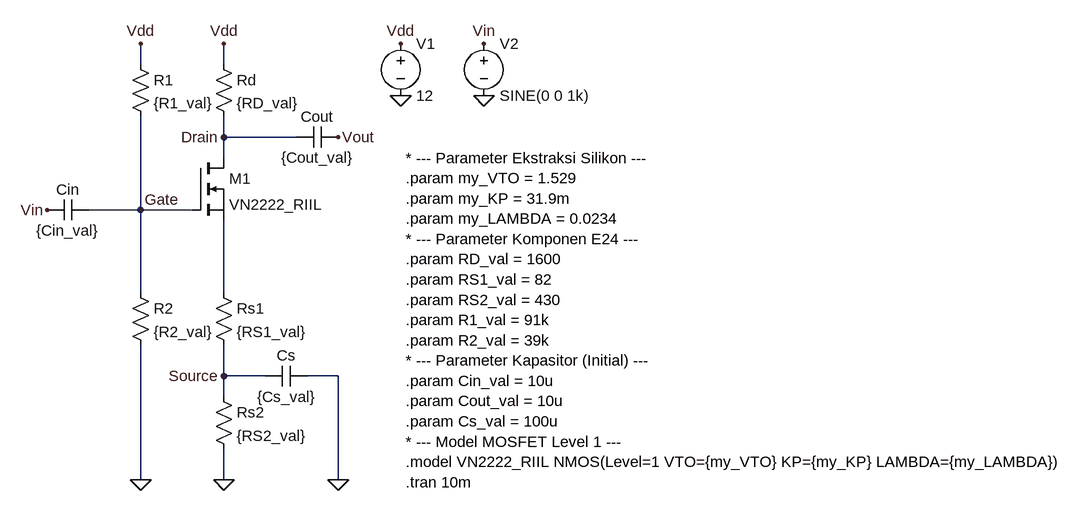
[diagram p0: schematic CS_Amp_Baseline.asc]
CS_Amp_Baseline.asc, the LTspice schematic file:
Version 4
SHEET 1 2624 1128
WIRE -320 64 -320 32
WIRE -192 64 -192 32
WIRE -192 176 -192 144
WIRE -80 176 -192 176
WIRE -192 208 -192 176
WIRE -320 288 -320 144
WIRE -320 288 -400 288
WIRE -240 288 -320 288
WIRE -320 416 -320 288
WIRE -192 416 -192 304
WIRE -192 544 -192 496
WIRE -128 544 -192 544
WIRE -16 544 -64 544
WIRE -192 576 -192 544
WIRE -320 704 -320 496
WIRE -192 704 -192 656
WIRE -16 704 -16 544
FLAG -192 704 0
FLAG -192 32 Vdd
FLAG -320 704 0
FLAG -320 32 Vdd
FLAG -16 704 0
FLAG 80 112 0
FLAG 80 32 Vdd
FLAG -16 176 Vout
FLAG -464 288 Vin
FLAG 208 112 0
FLAG 208 32 Vin
FLAG -192 176 Drain
FLAG -320 288 Gate
FLAG -192 544 Source
SYMBOL nmos -240 208 R0
SYMATTR InstName M1
SYMATTR Value VN2222_RIIL
SYMBOL Res -208 400 R0
SYMATTR InstName Rs1
SYMATTR Value {RS1_val}
SYMBOL Res -208 48 R0
SYMATTR InstName Rd
SYMATTR Value {RD_val}
SYMBOL Res -208 560 R0
SYMATTR InstName Rs2
SYMATTR Value {RS2_val}
SYMBOL Res -336 48 R0
SYMATTR InstName R1
SYMATTR Value {R1_val}
SYMBOL Res -336 400 R0
SYMATTR InstName R2
SYMATTR Value {R2_val}
SYMBOL Cap -64 528 R90
WINDOW 0 0 32 VBottom 2
WINDOW 3 32 32 VTop 2
SYMATTR InstName Cs
SYMATTR Value {Cs_val}
SYMATTR SpiceLine V=al}\
SYMBOL Voltage 80 16 R0
SYMATTR InstName V1
SYMATTR Value 12
SYMBOL Cap -400 272 R90
WINDOW 0 0 32 VBottom 2
WINDOW 3 32 32 VTop 2
SYMATTR InstName Cin
SYMATTR Value {Cin_val}
SYMBOL Cap -16 160 R90
WINDOW 0 0 32 VBottom 2
WINDOW 3 32 32 VTop 2
SYMATTR InstName Cout
SYMATTR Value {Cout_val}
SYMBOL Voltage 208 16 R0
SYMATTR InstName V2
SYMATTR Value SINE(0 0 1k)
TEXT 88 208 Left 2 !* --- Parameter Ekstraksi Silikon ---\n.param my_VTO = 1.529\n.param my_KP = 31.9m\n.param my_LAMBDA = 0.0234\n* --- Parameter Komponen E24 ---\n.param RD_val = 1600\n.param RS1_val = 82\n.param RS2_val = 430\n.param R1_val = 91k\n.param R2_val = 39k\n* --- Parameter Kapasitor (Initial) ---\n.param Cin_val = 10u\n.param Cout_val = 10u\n.param Cs_val = 100u\n* --- Model MOSFET Level 1 ---\n.model VN2222_RIIL NMOS(Level=1 VTO={my_VTO} KP={my_KP} LAMBDA={my_LAMBDA})\n.tran 10m

The netlist it stands for:
* CS_Amp_Baseline.asc
M1 Drain Gate N001 N001 VN2222_RIIL
Rs1 N001 Source {RS1_val}
Rd Vdd Drain {RD_val}
Rs2 Source 0 {RS2_val}
R1 Vdd Gate {R1_val}
R2 Gate 0 {R2_val}
Cs 0 Source {Cs_val} V=al}\
V1 Vdd 0 12
Cin Gate Vin {Cin_val}
Cout Vout Drain {Cout_val}
V2 Vin 0 SINE(0 0 1k)
.model NMOS NMOS
.model PMOS PMOS
.lib standard.mos
* --- Parameter Ekstraksi Silikon ---
.param my_VTO = 1.529
.param my_KP = 31.9m
.param my_LAMBDA = 0.0234
* --- Parameter Komponen E24 ---
.param RD_val = 1600
.param RS1_val = 82
.param RS2_val = 430
.param R1_val = 91k
.param R2_val = 39k
* --- Parameter Kapasitor (Initial) ---
.param Cin_val = 10u
.param Cout_val = 10u
.param Cs_val = 100u
* --- Model MOSFET Level 1 ---
.model VN2222_RIIL NMOS(Level=1 VTO={my_VTO} KP={my_KP} LAMBDA={my_LAMBDA})
.tran 10m
.backanno
.end